# Altium schematic sheet 01_MCU_DSP..SchDoc
size A3; SheetNumber: 1; SheetTotal: 6
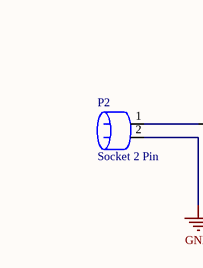
[diagram p0: 01_MCU_DSP..SchDoc, bottom left]
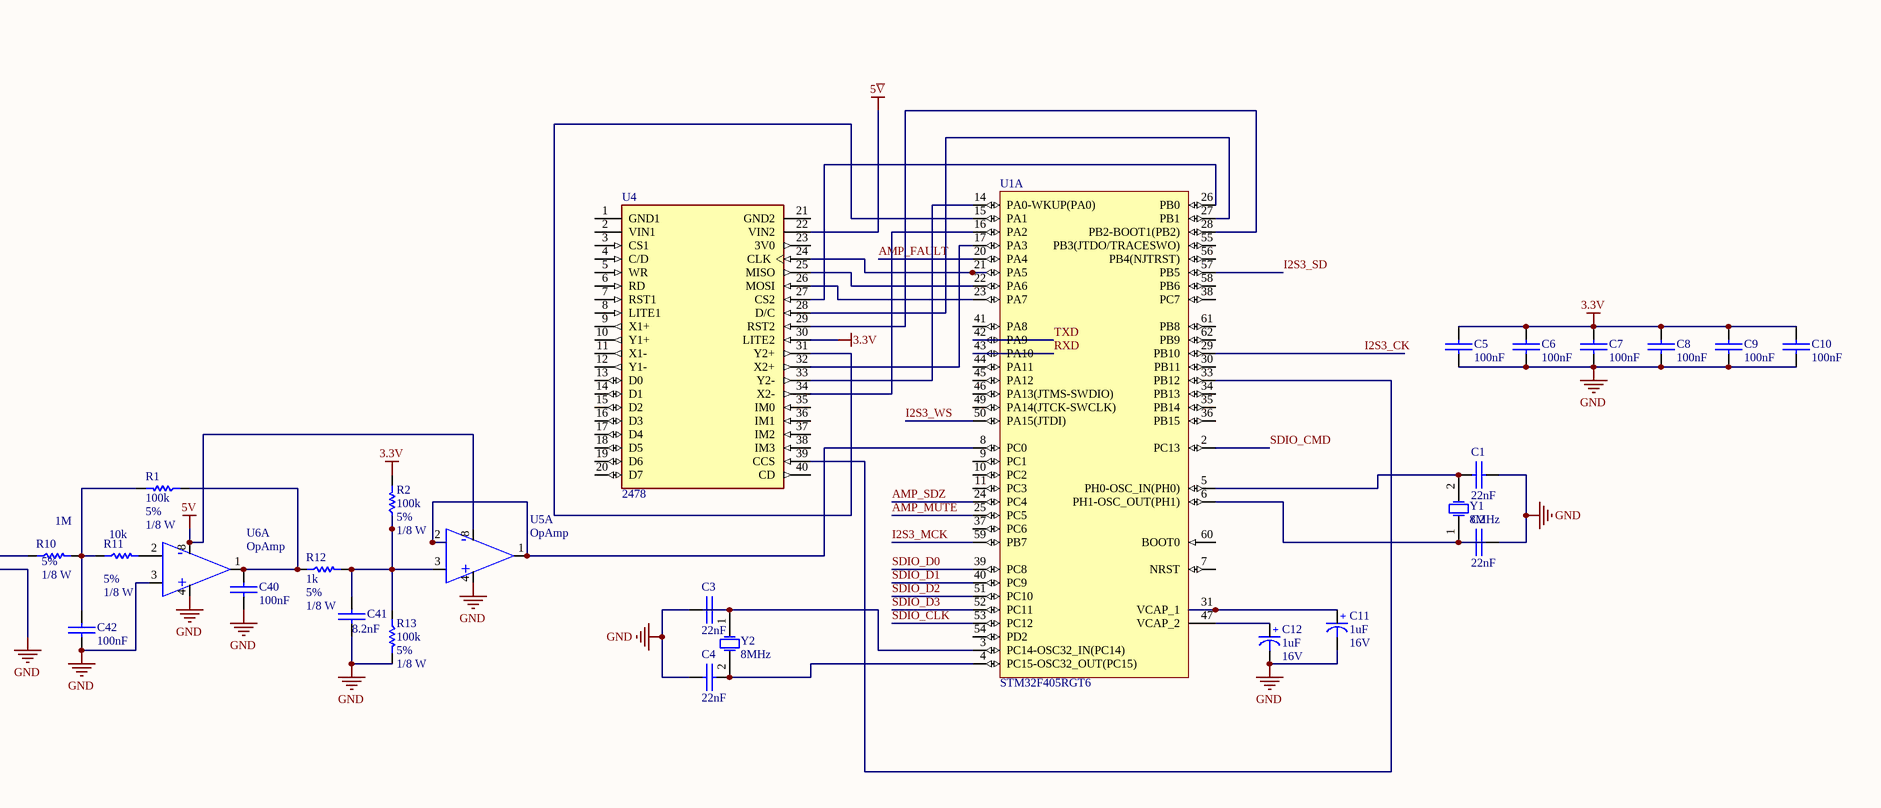
[diagram p1: 01_MCU_DSP..SchDoc, bottom right]

## Parts
C1  22nF  [SMD_CAP_1206]
C2  22nF  [SMD_CAP_1206]
C3  22nF  [SMD_CAP_1206]
C4  22nF  [SMD_CAP_1206]
C5  100nF  [SMD_CAP_1206]
C6  100nF  [SMD_CAP_1206]
C7  100nF  [SMD_CAP_1206]
C8  100nF  [SMD_CAP_1206]
C9  100nF  [SMD_CAP_1206]
C10  100nF  [SMD_CAP_1206]
C11  Voltage: 16V  [cap 01]  (hidden comment: 1uF)
C12  Voltage: 16V  [cap 01]  (hidden comment: 1uF)
C40  100nF  [SMD_CAP_1206]
C41  8.2nF  [SMD_CAP_1206]
C42  100nF  [SMD_CAP_1206]
P2  Socket 2 Pin  [2pin]
R1  Tolerance: 5%  Power: 1/8 W  [RES 0805 (2012X06L)]  (hidden comment: 100k)
R2  Tolerance: 5%  Power: 1/8 W  [RES 0805 (2012X06L)]  (hidden comment: 100k)
R10  Tolerance: 5%  Power: 1/8 W  [RES 0805 (2012X06L)]  (hidden comment: 1M)
R11  Tolerance: 5%  Power: 1/8 W  [RES 0805 (2012X06L)]  (hidden comment: 10k)
R12  Tolerance: 5%  Power: 1/8 W  [RES 0805 (2012X06L)]  (hidden comment: 1k)
R13  Tolerance: 5%  Power: 1/8 W  [RES 0805 (2012X06L)]  (hidden comment: 100k)
U1  STM32F405RGT6  [STM-LQFP64_N]  (part A of 2)
U4  2478  [ADAFRUIT_2478]
U5  OpAmp  [SOIC8-Narrow]  (part A of 2)
U6  OpAmp  [SOIC8-Narrow]  (part A of 2)
Y1  8MHz  [XTAL Small]
Y2  8MHz  [XTAL Small]

## Nets
3.3V: C5.1(+) C6.1(+) C7.1(+) C8.1(+) C9.1(+) C10.1(+) R2.2 U4.30(LITE2)
5V: U5.8(V+) U6.8(V+)
5~{V}: U4.22(VIN2)
GND: C1.2(-) C2.2(-) C3.2(-) C4.2(-) C5.2(-) C6.2(-) C7.2(-) C8.2(-) C9.2(-) C10.2(-) C11.2(-) C12.2(-) C40.2(-) C41.2(-) C42.2(-) P2.2 R13.2 U5.4(V-) U6.3(Noninverter_Input) U6.4(V-)
AMP_FAULT: U1.20(PA4)
AMP_MUTE: U1.25(PC5)
AMP_SDZ: U1.24(PC4)
I2S3_CK: U1.29(PB10)
I2S3_MCK: U1.59(PB7)
I2S3_SD: U1.57(PB5)
I2S3_WS: U1.50(PA15(JTDI))
RXD: U1.43(PA10)
SDIO_CLK: U1.53(PC12)
SDIO_CMD: U1.2(PC13)
SDIO_D0: U1.39(PC8)
SDIO_D1: U1.40(PC9)
SDIO_D2: U1.51(PC10)
SDIO_D3: U1.52(PC11)
TXD: U1.42(PA9)
NetC1_1: C1.1(+) U1.5(PH0-OSC_IN(PH0)) Y1.2(OSC2)
NetC2_1: C2.1(+) U1.6(PH1-OSC_OUT(PH1)) Y1.1(OSC1)
NetC3_1: C3.1(+) U1.3(PC14-OSC32_IN(PC14)) Y2.1(OSC1)
NetC4_1: C4.1(+) U1.4(PC15-OSC32_OUT(PC15)) Y2.2(OSC2)
NetC11_1: C11.1(+) U1.31(VCAP_1)
NetC12_1: C12.1(+) U1.47(VCAP_2)
NetC40_1: C40.1(+) R1.1 R12.1 U6.1(Output)
NetC41_1: C41.1(+) R2.1 R12.2 R13.1 U5.3(Noninverter_Input)
NetC42_1: C42.1(+) R1.2 R10.2 R11.1
NetP2_1: P2.1 R10.1
NetR11_2: R11.2 U6.2(Inverter_Input)
NetU1_8: U1.8(PC0) U5.1(Output) U5.2(Inverter_Input)
NetU1_14: U1.14(PA0-WKUP(PA0)) U4.33(Y2-)
NetU1_15: U1.15(PA1) U4.31(Y2+)
NetU1_16: U1.16(PA2) U4.34(X2-)
NetU1_17: U1.17(PA3) U4.32(X2+)
NetU1_21: U1.21(PA5) U4.24(CLK)
NetU1_22: U1.22(PA6) U4.25(MISO)
NetU1_23: U1.23(PA7) U4.26(MOSI)
NetU1_26: U1.26(PB0) U4.27(CS2)
NetU1_27: U1.27(PB1) U4.28(D/C)
NetU1_28: U1.28(PB2-BOOT1(PB2)) U4.29(RST2)
NetU1_33: U1.33(PB12) U4.39(CCS)

Not connected (* = marked no-connect by the designer): U1 7(NRST) 9(PC1) 10(PC2) 11(PC3) 30(PB11) 34(PB13) 35(PB14) 36(PB15) 37(PC6) 38(PC7) 41(PA8) 44(PA11) 45(PA12) 46(PA13(JTMS-SWDIO)) 49(PA14(JTCK-SWCLK)) 54(PD2) 55(PB3(JTDO/TRACESWO)) 56(PB4(NJTRST)) 58(PB6) 60(BOOT0) 61(PB8) 62(PB9); U4 1(GND1) 2(VIN1) 3(CS1) 4(C/D) 5(WR) 6(RD) 7(RST1) 8(LITE1) 9(X1+) 10(Y1+) 11(X1-) 12(Y1-) 13(D0) 14(D1) 15(D2) 16(D3) 17(D4) 18(D5) 19(D6) 20(D7) 21(GND2) 23(3V0) 35(IM0) 36(IM1) 37(IM2) 38(IM3) 40(CD)

## Notes on the sheet
- (in symbol OpAmp, part A) -; +

## Library data of the parts
C1-C10 C40-C42 = Cap-Bipolar: Bipolar Capacitor; Voltage: 100V; Designer: Saeid Jorablo; Organazation: ControTec; Adding Date: 1387/12/20
  C1-C4: Value: 22nF
  C5-C10 C40 C42: Value: 100nF
  C41: Value: 8.2nF
C11 C12 = Cap-Polar: Polar Capacitor; Designer: Saeid Jorablo; Organazation: ControTec; Adding Date: 1387/12/20; Value: 1uF
P2 = Socket 2 Pin: Power Input
R1 R2 R10-R13 = Resistor
  R1 R2 R13: Value: 100k
  R10: Value: 1M
  R11: Value: 10k
  R12: Value: 1k
U1 = STM32F405RGT6: ARM Cortex-M4 32-bit MCU+FPU, 210 DMIPS, 1024 kB Flash, 192 kB Internal RAM, 51 I/Os, 64-pin LQFP, -40 to 85 degC, Tray; Manufacturer: STMicroelectronics; D/A Converter: 2x12-bit; FLASH Size (Prog) (kB): 1024; I/Os (High Current): 51; Internal RAM Size (kB): 192; Operating Frequency(F) (Processor speed) (MHz): 168; Supply Voltage(Vcc) max (V): 3.6; Supply Voltage(Vcc) min (V): 1.8; DatasheetVersion: Rev. 4; PackageVersion: Rev. 4, 06/2013; PackageReference: LQFP64; PackageDescription: 64-Pin Low Profile Quad Flat Package, 10 x 10 mm Body, 0.5 mm Pitch; Supplier 1: Digi-Key; Supplier Part Number 1: 497-11767-ND; Supplier 2: Farnell; Supplier Part Number 2: 2064363; Supplier 3: Newark; Supplier Part Number 3: 73T2329; Supplier 4: Mouser; Supplier Part Number 4: 511-STM32F405RGT6; Core: ARM Cortex-M4; Packing: Tray; Mounting Technology: Surface Mount; PartNumber: STM32F405RGT6; ComponentLink1Description: Manufacturer URL; ComponentLink1URL: http://www.st.com/web/en/home.html; ComponentLink2Description: Datasheet; ComponentLink2URL: http://www.st.com/st-web-ui/static/active/en/resource/technical/document/datasheet/DM00037051.pdf; ComponentLink3Description: Package Specification; ComponentLink3URL: http://www.st.com/st-web-ui/static/active/en/resource/technical/document/datasheet/DM00037051.pdf
U4 = 2478: Resistive Graphic LCD Display Module Red, Green, Blue (RGB) TFT - Color Parallel, 8-Bit, SPI 2.4 (60.96mm) 240 x 320; MF: Adafruit Industries; Package: NON STANDARD Adafruit; Price: None; Value: *; SnapEDA_Link: https://www.snapeda.com/parts/2478/Adafruit+Industries+LLC/view-part/?ref=snap; MP: 2478; Availability: In Stock; Check_prices: https://www.snapeda.com/parts/2478/Adafruit+Industries+LLC/view-part/?ref=eda
U5 U6 = OpAmp: Dual Low Noise Operational Amplifier (OpAmp)
Y1 Y2 = XTAL: XTAL Crystal; Company: E.P.I.L; Design Date: 11/04/2011; Value: 8MHz